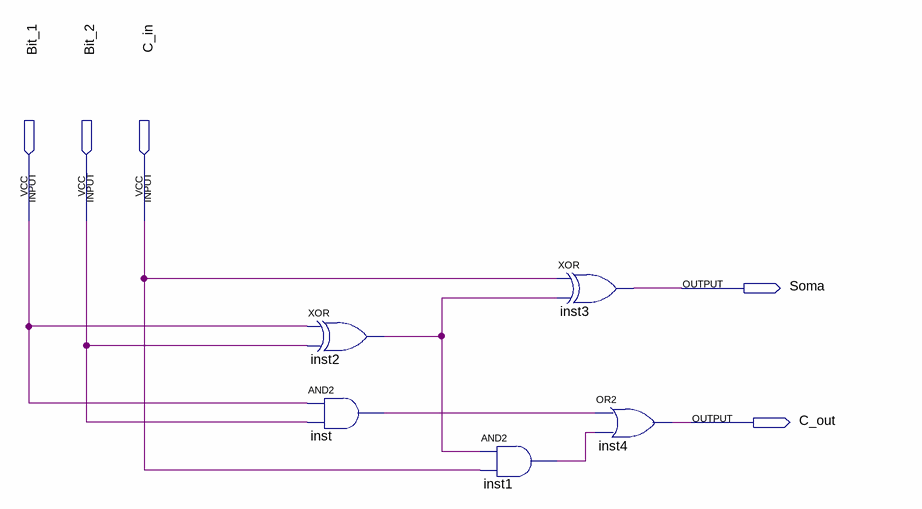
[diagram p0: schematic sheet]
// Quartus schematic somadorcompleto.bdf as structural Verilog: 5 symbols, 5 pins
module somadorcompleto (
  input  Bit_1,
  input  Bit_2,
  input  C_in,
  output Soma,
  output C_out
);

  wire inst1_out, inst2_out, inst_out;

  xor inst2 (inst2_out, Bit_1, Bit_2);
  and inst (inst_out, Bit_1, Bit_2);
  and inst1 (inst1_out, inst2_out, C_in);
  xor inst3 (Soma, C_in, inst2_out);
  or inst4 (C_out, inst_out, inst1_out);
endmodule
